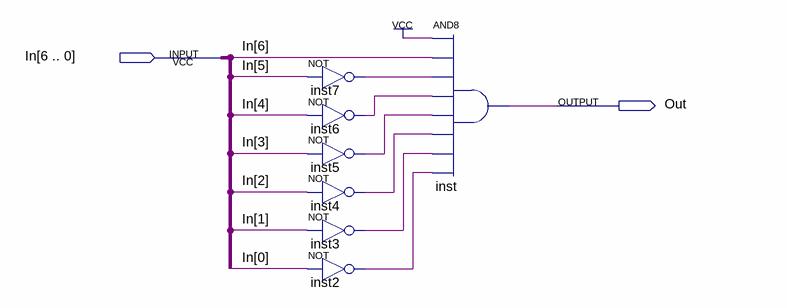
[diagram p0: schematic sheet]
// Quartus schematic On_solo_first_bit_on.bdf as structural Verilog: 7 symbols, 2 pins
module On_solo_first_bit_on (
  input  [6:0] In,
  output Out
);

  wire inst2_out, inst3_out, inst4_out, inst5_out, inst6_out, inst7_out;

  not inst7 (inst7_out, In[5]);
  not inst6 (inst6_out, In[4]);
  not inst5 (inst5_out, In[3]);
  not inst4 (inst4_out, In[2]);
  not inst3 (inst3_out, In[1]);
  not inst2 (inst2_out, In[0]);
  and inst (Out, 1'b1, In[6], inst7_out, inst6_out, inst5_out, inst4_out, inst3_out, inst2_out);
endmodule
